# Altium schematic sheet SOC_PWR.schdoc: =
size A3; Symbol: Sheet-Symbol_A4; Company: 嘉立创EDA; Version: V1.0; Page Size: A4; @Project Name: RK3568_LPD4X_120P_Core; @Page Count: 18; @Update Date: 2025-08-22; @Create Date: 2025-08-15; @Schematic Name: Schematic1; @Page No: 4; @Page Name: SOC_PWR; Device: Sheet-Symbol_A4; Border: 1; Title Block Position: 3; Width: 1655; Height: 1170; Region Start: 1; X Region Count: 6; Y Region Count: 4; Blade Width: 10; @Board Name: Board1; @Create Time: 13:49:34; @Update Time: 16:42:04; Organization: ORGANIZATION; Address1: ADDRESS 1; Address2: ADDRESS 2; Address3: ADDRESS 3; Address4: ADDRESS 4; SheetNumber: 7; SheetTotal: 28
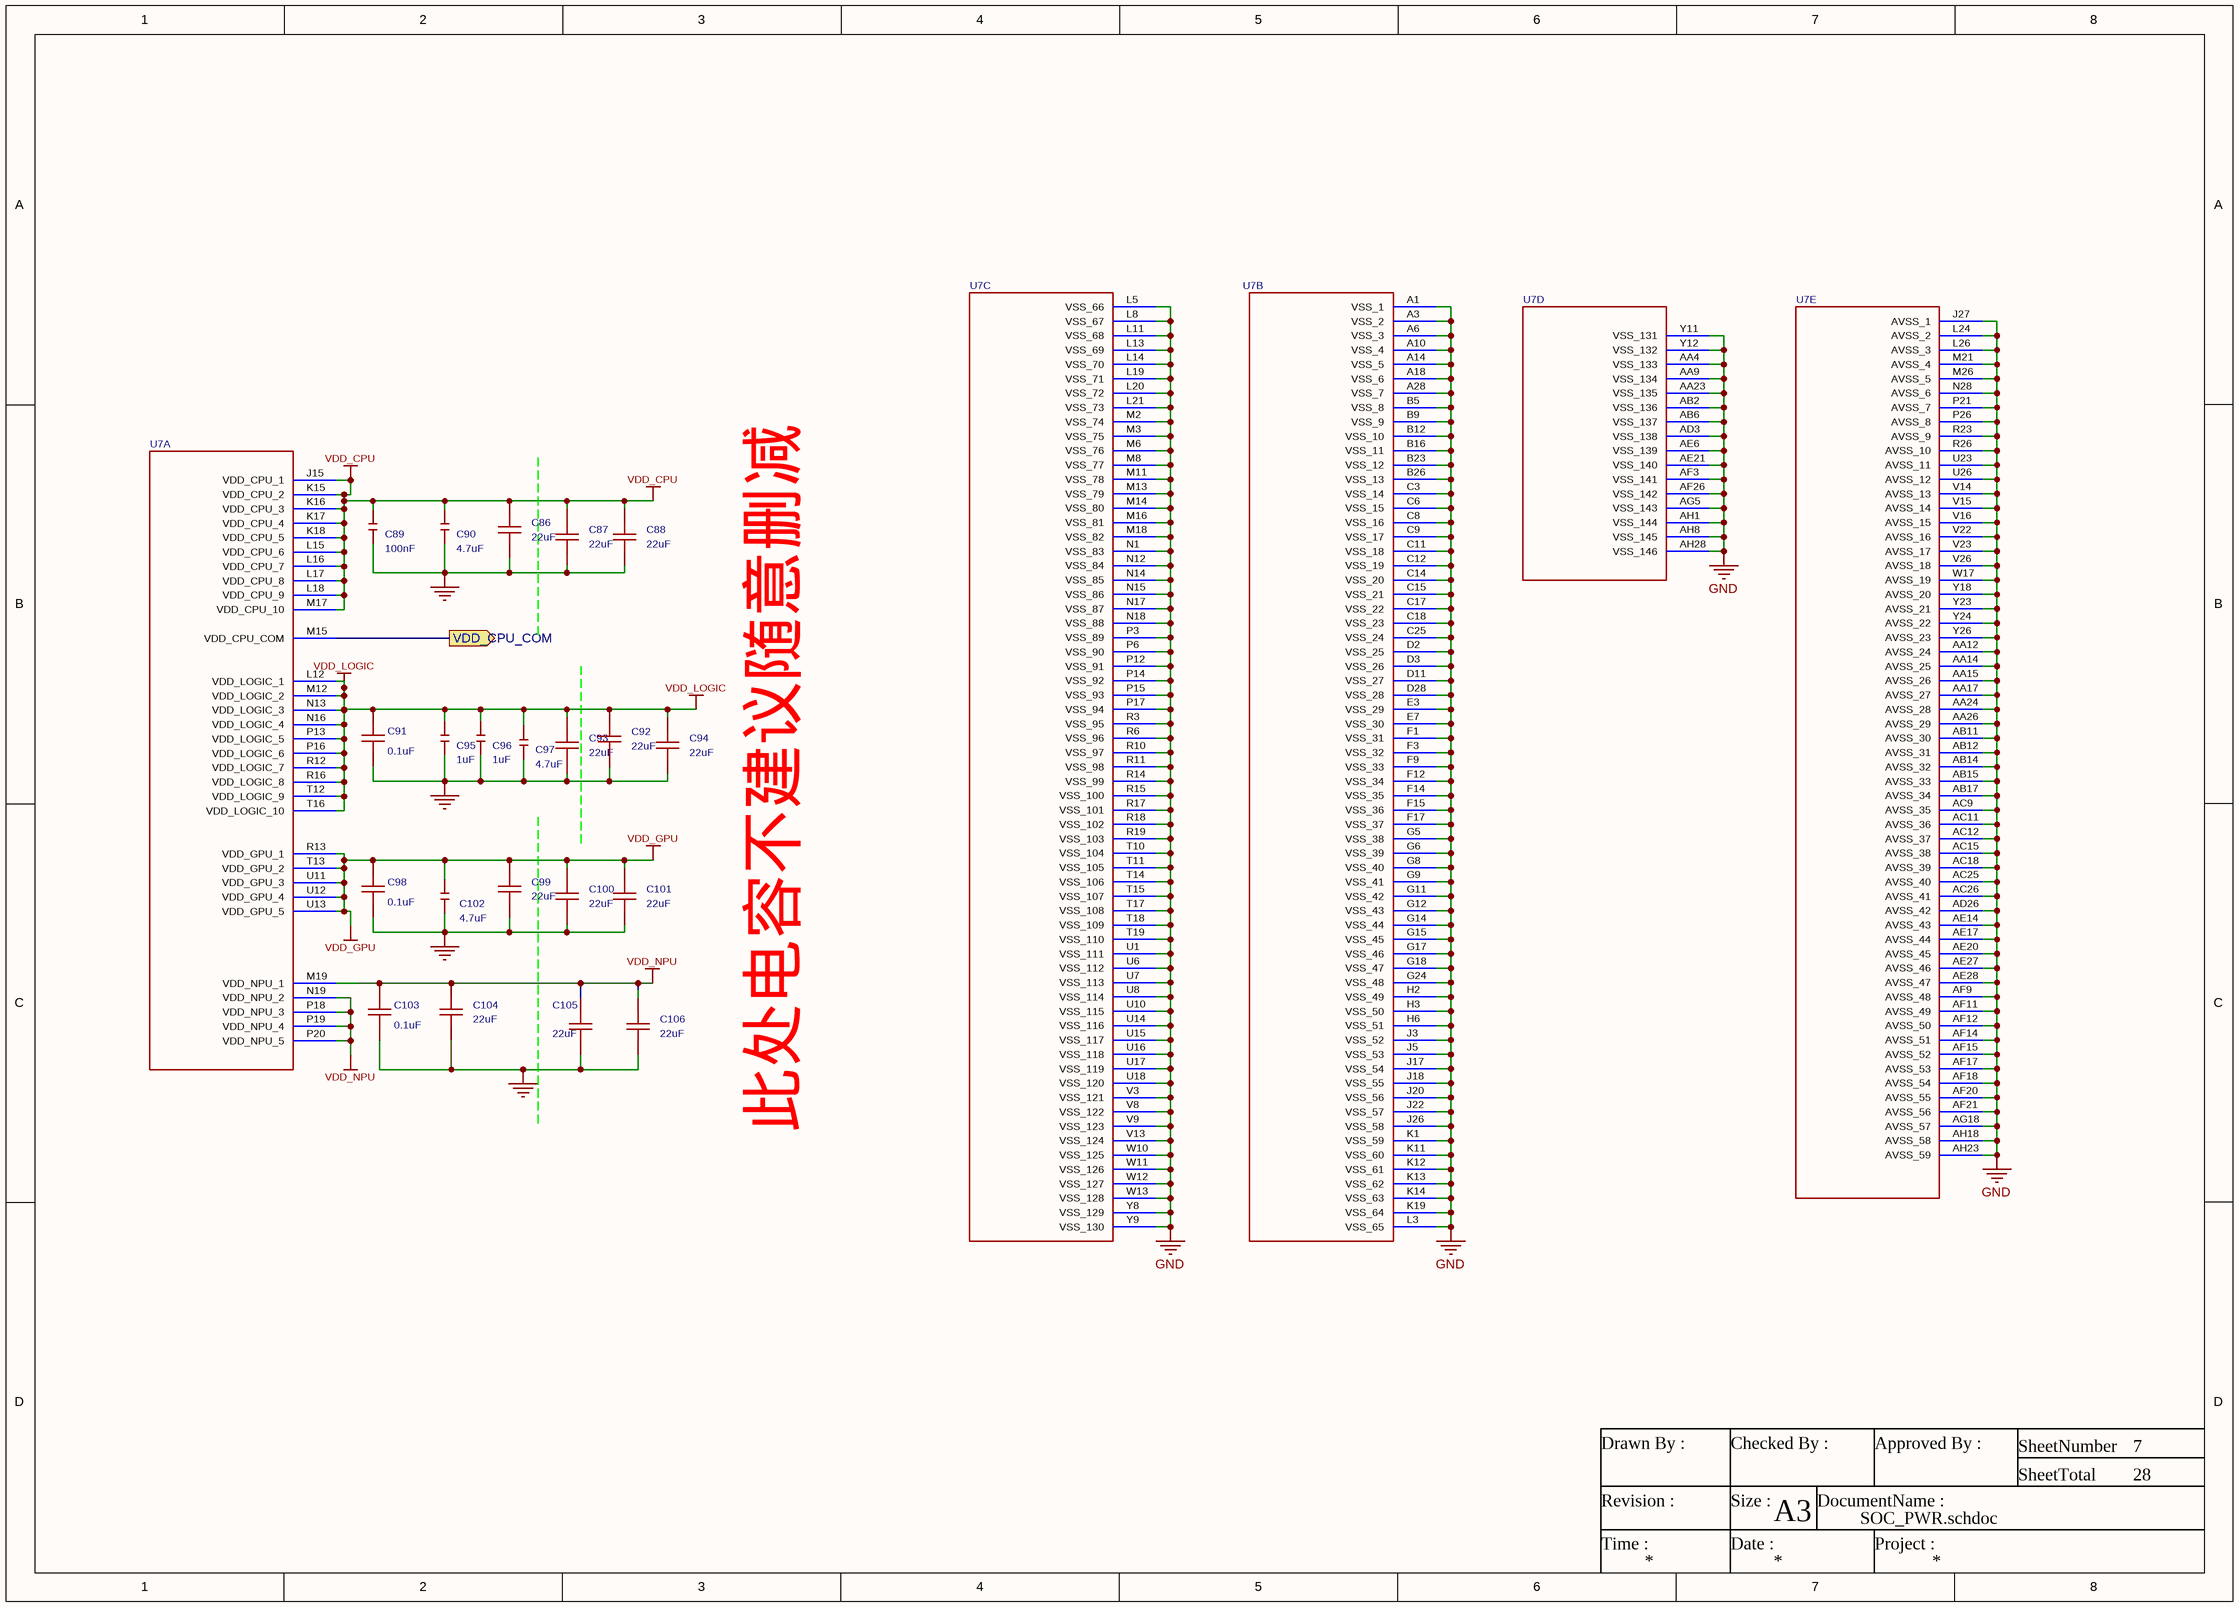
[diagram p0: SOC_PWR.schdoc]

## Parts
C86  22uF  [C0603]
C87  22uF  [C0603]
C88  22uF  [C0603]
C89  100nF  [MYC0402]
C90  4.7uF  [MYC0402]
C91  0.1uF  [C0201]
C92  22uF  [C0603]
C93  22uF  [C0603]
C94  22uF  [C0603]
C95  1uF  [MYC0402]
C96  1uF  [MYC0402]
C97  4.7uF  [MYC0402]
C98  0.1uF  [C0201]
C99  22uF  [C0603]
C100  22uF  [C0603]
C101  22uF  [C0603]
C102  4.7uF  [MYC0402]
C103  0.1uF  [C0201]
C104  22uF  [C0603]
C105  22uF  [C0603]
C106  22uF  [C0603]
U7  RK3568  [BGA-636_L19.0-W19.0-P0.65-BL]  (value not drawn)  (parts A,B,C,D,E of 23)

## Ports
VDD_CPU_COM (out)

## Nets
GND: C86.1 C87.1 C88.1 C89.1 C90.1 C91.1 C92.1 C93.1 C94.1 C95.1 C96.1 C97.1 C98.1 C99.1 C100.1 C101.1 C102.1 C103.1 C104.1 C105.1 C106.1 U7.A1(VSS_1) U7.A3(VSS_2) U7.A6(VSS_3) U7.A10(VSS_4) U7.A14(VSS_5) U7.A18(VSS_6) U7.A28(VSS_7) U7.AA4(VSS_133) U7.AA9(VSS_134) U7.AA12(AVSS_24) U7.AA14(AVSS_25) U7.AA15(AVSS_26) U7.AA17(AVSS_27) U7.AA23(VSS_135) U7.AA24(AVSS_28) U7.AA26(AVSS_29) U7.AB2(VSS_136) U7.AB6(VSS_137) U7.AB11(AVSS_30) U7.AB12(AVSS_31) U7.AB14(AVSS_32) U7.AB15(AVSS_33) U7.AB17(AVSS_34) U7.AC9(AVSS_35) U7.AC11(AVSS_36) U7.AC12(AVSS_37) U7.AC15(AVSS_38) U7.AC18(AVSS_39) U7.AC25(AVSS_40) U7.AC26(AVSS_41) U7.AD3(VSS_138) U7.AD26(AVSS_42) U7.AE6(VSS_139) U7.AE14(AVSS_43) U7.AE17(AVSS_44) U7.AE20(AVSS_45) U7.AE21(VSS_140) U7.AE27(AVSS_46) U7.AE28(AVSS_47) U7.AF3(VSS_141) U7.AF9(AVSS_48) U7.AF11(AVSS_49) U7.AF12(AVSS_50) U7.AF14(AVSS_51) U7.AF15(AVSS_52) U7.AF17(AVSS_53) U7.AF18(AVSS_54) U7.AF20(AVSS_55) U7.AF21(AVSS_56) U7.AF26(VSS_142) U7.AG5(VSS_143) U7.AG18(AVSS_57) U7.AH1(VSS_144) U7.AH8(VSS_145) U7.AH18(AVSS_58) U7.AH23(AVSS_59) U7.AH28(VSS_146) U7.B5(VSS_8) U7.B9(VSS_9) U7.B12(VSS_10) U7.B16(VSS_11) U7.B23(VSS_12) U7.B26(VSS_13) U7.C3(VSS_14) U7.C6(VSS_15) U7.C8(VSS_16) U7.C9(VSS_17) U7.C11(VSS_18) U7.C12(VSS_19) U7.C14(VSS_20) U7.C15(VSS_21) U7.C17(VSS_22) U7.C18(VSS_23) U7.C25(VSS_24) U7.D2(VSS_25) U7.D3(VSS_26) U7.D11(VSS_27) U7.D28(VSS_28) U7.E3(VSS_29) U7.E7(VSS_30) U7.F1(VSS_31) U7.F3(VSS_32) U7.F9(VSS_33) U7.F12(VSS_34) U7.F14(VSS_35) U7.F15(VSS_36) U7.F17(VSS_37) U7.G5(VSS_38) U7.G6(VSS_39) U7.G8(VSS_40) U7.G9(VSS_41) U7.G11(VSS_42) U7.G12(VSS_43) U7.G14(VSS_44) U7.G15(VSS_45) U7.G17(VSS_46) U7.G18(VSS_47) U7.G24(VSS_48) U7.H2(VSS_49) U7.H3(VSS_50) U7.H6(VSS_51) U7.J3(VSS_52) U7.J5(VSS_53) U7.J17(VSS_54) U7.J18(VSS_55) U7.J20(VSS_56) U7.J22(VSS_57) U7.J26(VSS_58) U7.J27(AVSS_1) U7.K1(VSS_59) U7.K11(VSS_60) U7.K12(VSS_61) U7.K13(VSS_62) U7.K14(VSS_63) U7.K19(VSS_64) U7.L3(VSS_65) U7.L5(VSS_66) U7.L8(VSS_67) U7.L11(VSS_68) U7.L13(VSS_69) U7.L14(VSS_70) U7.L19(VSS_71) U7.L20(VSS_72) U7.L21(VSS_73) U7.L24(AVSS_2) U7.L26(AVSS_3) U7.M2(VSS_74) U7.M3(VSS_75) U7.M6(VSS_76) U7.M8(VSS_77) U7.M11(VSS_78) U7.M13(VSS_79) U7.M14(VSS_80) U7.M16(VSS_81) U7.M18(VSS_82) U7.M21(AVSS_4) U7.M26(AVSS_5) U7.N1(VSS_83) U7.N12(VSS_84) U7.N14(VSS_85) U7.N15(VSS_86) U7.N17(VSS_87) U7.N18(VSS_88) U7.N28(AVSS_6) U7.P3(VSS_89) U7.P6(VSS_90) U7.P12(VSS_91) U7.P14(VSS_92) U7.P15(VSS_93) U7.P17(VSS_94) U7.P21(AVSS_7) U7.P26(AVSS_8) U7.R3(VSS_95) U7.R6(VSS_96) U7.R10(VSS_97) U7.R11(VSS_98) U7.R14(VSS_99) U7.R15(VSS_100) U7.R17(VSS_101) U7.R18(VSS_102) U7.R19(VSS_103) U7.R23(AVSS_9) U7.R26(AVSS_10) U7.T10(VSS_104) U7.T11(VSS_105) U7.T14(VSS_106) U7.T15(VSS_107) U7.T17(VSS_108) U7.T18(VSS_109) U7.T19(VSS_110) U7.U1(VSS_111) U7.U6(VSS_112) U7.U7(VSS_113) U7.U8(VSS_114) U7.U10(VSS_115) U7.U14(VSS_116) U7.U15(VSS_117) U7.U16(VSS_118) U7.U17(VSS_119) U7.U18(VSS_120) U7.U23(AVSS_11) U7.U26(AVSS_12) U7.V3(VSS_121) U7.V8(VSS_122) U7.V9(VSS_123) U7.V13(VSS_124) U7.V14(AVSS_13) U7.V15(AVSS_14) U7.V16(AVSS_15) U7.V22(AVSS_16) U7.V23(AVSS_17) U7.V26(AVSS_18) U7.W10(VSS_125) U7.W11(VSS_126) U7.W12(VSS_127) U7.W13(VSS_128) U7.W17(AVSS_19) U7.Y8(VSS_129) U7.Y9(VSS_130) U7.Y11(VSS_131) U7.Y12(VSS_132) U7.Y18(AVSS_20) U7.Y23(AVSS_21) U7.Y24(AVSS_22) U7.Y26(AVSS_23)
VDD_CPU: C86.2 C87.2 C88.2 C89.2 C90.2 U7.J15(VDD_CPU_1) U7.K15(VDD_CPU_2) U7.K16(VDD_CPU_3) U7.K17(VDD_CPU_4) U7.K18(VDD_CPU_5) U7.L15(VDD_CPU_6) U7.L16(VDD_CPU_7) U7.L17(VDD_CPU_8) U7.L18(VDD_CPU_9) U7.M17(VDD_CPU_10)
VDD_GPU: C98.2 C99.2 C100.2 C101.2 C102.2 U7.R13(VDD_GPU_1) U7.T13(VDD_GPU_2) U7.U11(VDD_GPU_3) U7.U12(VDD_GPU_4) U7.U13(VDD_GPU_5)
VDD_LOGIC: C91.2 C92.2 C93.2 C94.2 C95.2 C96.2 C97.2 U7.L12(VDD_LOGIC_1) U7.M12(VDD_LOGIC_2) U7.N13(VDD_LOGIC_3) U7.N16(VDD_LOGIC_4) U7.P13(VDD_LOGIC_5) U7.P16(VDD_LOGIC_6) U7.R12(VDD_LOGIC_7) U7.R16(VDD_LOGIC_8) U7.T12(VDD_LOGIC_9) U7.T16(VDD_LOGIC_10)
VDD_NPU: C103.2 C104.2 C105.2 C106.2 U7.M19(VDD_NPU_1) U7.N19(VDD_NPU_2) U7.P18(VDD_NPU_3) U7.P19(VDD_NPU_4) U7.P20(VDD_NPU_5)
VDD_CPU_COM: U7.M15(VDD_CPU_COM) ; port VDD_CPU_COM

## Notes on the sheet
- 此处电容不建议随意删减
- Drawn By :
- Checked By :
- Approved By :
- SheetNumber
- SheetTotal
- Revision :
- Time :
- Size :
- Date :
- A3
- DocumentName :
- Project :

## Library data of the parts
C86 C92-C94 C99-C101 C104-C106 = CAP_0603: Symbol: Capacitance; 3D Model: ac125912035d415993ca9572d50418b1; 3D Model Transform: 62.992,31.496,0,0,0,0,0,0,0; ConvertToPcb: yes; ModelName: C0603_L1.6-W0.8-H0.8; Device: CAP_0603; Value: 22uF; Supplier Footprint: 0603; AddInBom: yes; FootprintName: C0603
C87 C88 = CAP_0603: ConvertToPcb: yes; SymbolName: Capacitance; ModelId: ac125912035d415993ca9572d50418b1; ModelName: C0603_L1.6-W0.8-H0.8; ModelTransform: 62.992,31.496,0,0,0,0,0,0,0; Value: 22uF; Device: CAP_0603; AddInBom: yes; Supplier Footprint: 0603; FootprintName: C0603
C89 C90 C95-C97 C102 = MYC0402: C0402电容; Symbol: MY_C0201; AddInBom: yes; Device: MYC0402; ConvertToPcb: yes; FootprintName: MYC0402
  C89: Value: 100nF
  C90 C97 C102: Value: 4.7uF
  C95 C96: Value: 1uF
C91 C98 C103 = GRM035R60J475ME15D: 容值:4.7uF;精度:±20%;额定电压:6.3V;温度系数:X5R;; Manufacturer: muRata(村田); AddInBom: yes; ModelId: e8033a7cb35143ffb28e3b81b2577ea0; ModelName: C0201_L0.6-W0.3-H0.3; ModelTransform: 23.622,11.811,0,0,0,0,0,0,0; Tolerance: ±20%; Voltage Rating: 6.3V; Temperature Coefficient: X5R; Symbol: GRM035R60J475ME15D; Value: 0.1uF; Device: GRM035R60J475ME15D; LCSC Part Name: 4.7uF ±20% 6.3V; ManufacturerPart: GRM035R60J475ME15D; Supplier Footprint: 0201; JLCPCB Part Class: Extended Part; Datasheet: https://item.szlcsc.com/datasheet/GRM035R60J475ME15D/313624.html; Supplier: LCSC; ConvertToPcb: yes; FootprintName: C0201
U7 = RK3568: ConvertToPcb: yes; ModelId: e6756cba1b9f43448429fdcd1d44d9d9; ModelTransform: 748.03,748.03,54.33,0,0,0,0,0,0; Symbol: RK3568; Device: RK3568; AddInBom: yes; FootprintName: BGA-636_L19.0-W19.0-P0.65-BL; ModelName: BGA-636_L19.0-W19.0-P0.65-BL